# Altium schematic sheet Clocking.SchDoc: {Наименование}
size 420 x 297 mm; DocumentNumber: ПЛАС.ХХХХХХ.ХХХ ХХ; SheetNumber: 6; SheetTotal: 11; PageSetup: Record=PageOptions|CenterHorizontal=False|CenterVertical=False|PrintScale=0.95|XCorrection=0.00|YCorrection=0.00|PrintKind=1|BorderSize=5000000|LeftOffset=0|BottomOffset=0|Orientation=1|PaperLength=1000|PaperWidth=1000|Scale=100|PaperSource=15|PrintQuality=600|MediaType=1|DitherType=10|PaperKind=A4|PrintScaleMode=1; Rule: PcbType=ProtelPcb
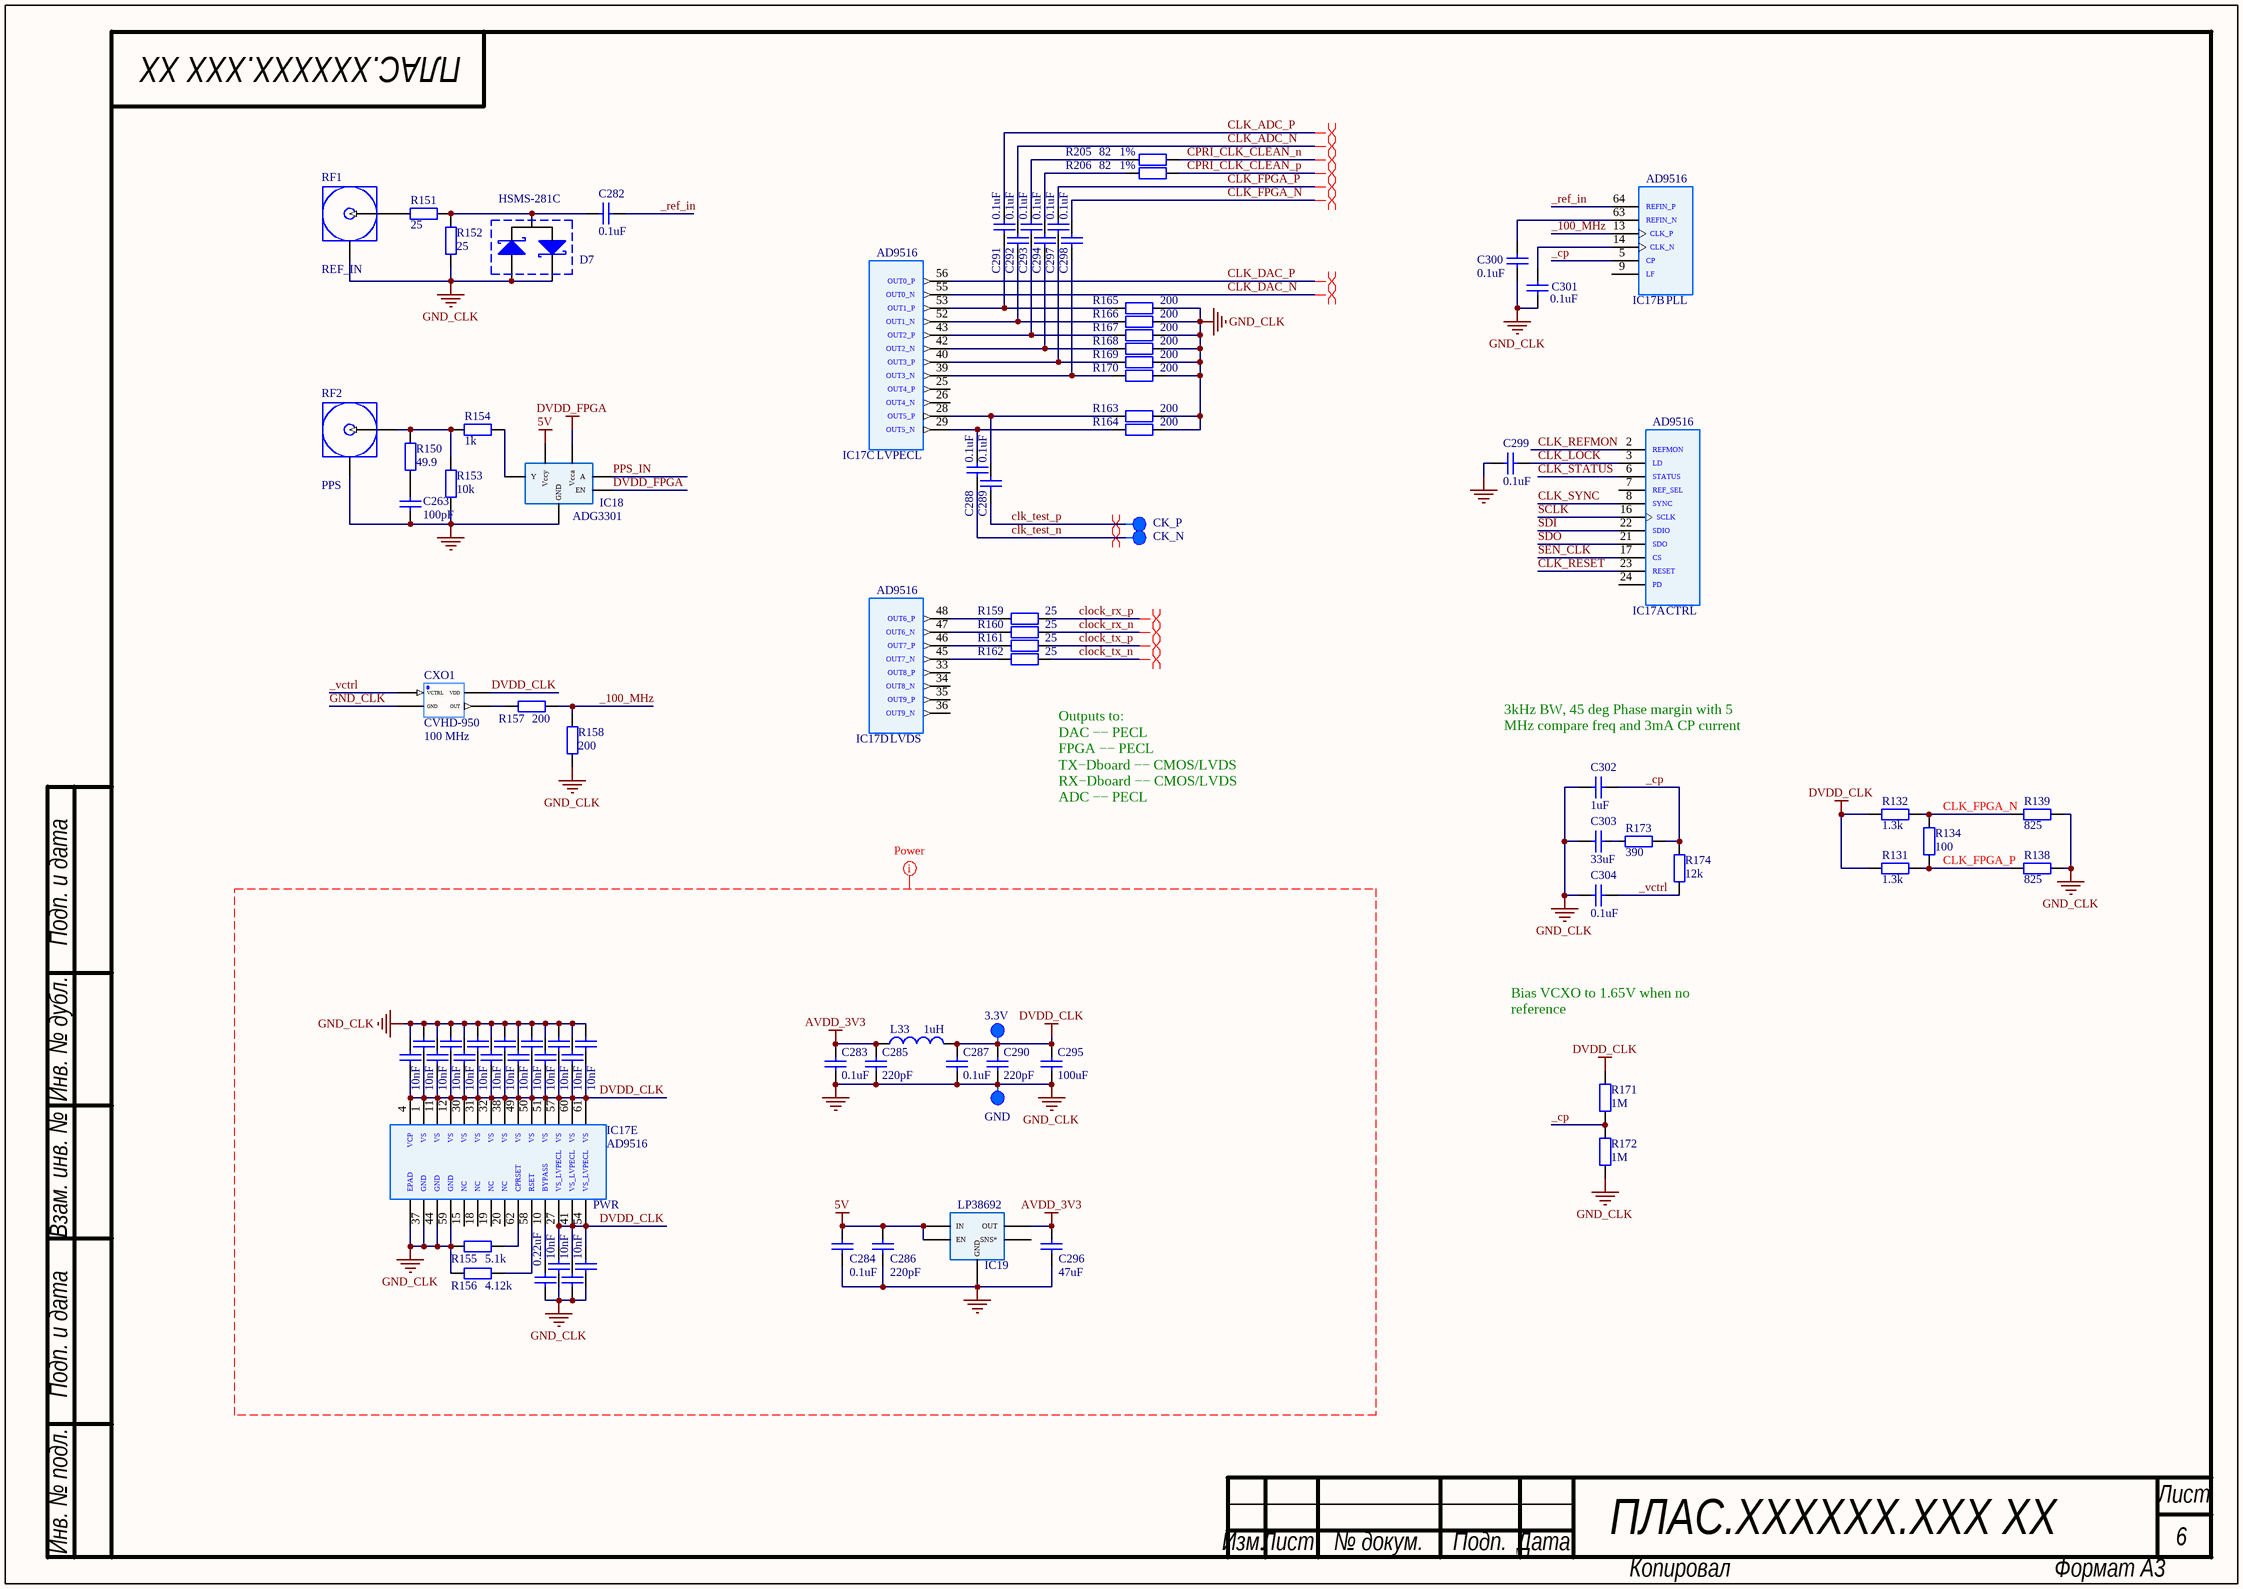
[diagram p0: Clocking.SchDoc]

## Parts
C263  value 100pF  [С0402]  (hidden comment: Cap)
C264  value 10nF  [С0402]  (hidden comment: Cap)
C265  value 10nF  [С0402]  (hidden comment: Cap)
C266  value 10nF  [С0402]  (hidden comment: Cap)
C267  value 10nF  [С0402]  (hidden comment: Cap)
C268  value 10nF  [С0402]  (hidden comment: Cap)
C269  value 10nF  [С0402]  (hidden comment: Cap)
C270  value 10nF  [С0402]  (hidden comment: Cap)
C271  value 10nF  [С0402]  (hidden comment: Cap)
C272  value 10nF  [С0402]  (hidden comment: Cap)
C273  value 10nF  [С0402]  (hidden comment: Cap)
C274  value 10nF  [С0402]  (hidden comment: Cap)
C275  value 0.22uF  [С0402]  (hidden comment: Cap)
C276  value 10nF  [С0402]  (hidden comment: Cap)
C277  value 10nF  [С0402]  (hidden comment: Cap)
C278  value 10nF  [С0402]  (hidden comment: Cap)
C279  value 10nF  [С0402]  (hidden comment: Cap)
C280  value 10nF  [С0402]  (hidden comment: Cap)
C281  value 10nF  [С0402]  (hidden comment: Cap)
C282  value 0.1uF  [С0402]  (hidden comment: Cap)
C283  value 0.1uF  [C0603]  (hidden comment: Cap)
C284  value 0.1uF  [C0603]  (hidden comment: Cap)
C285  value 220pF  [C0603]  (hidden comment: Cap)
C286  value 220pF  [C0603]  (hidden comment: Cap)
C287  value 0.1uF  [C0603]  (hidden comment: Cap)
C288  value 0.1uF  [С0402]  (hidden comment: Cap)
C289  value 0.1uF  [С0402]  (hidden comment: Cap)
C290  value 220pF  [C0603]  (hidden comment: Cap)
C291  value 0.1uF  [С0402]  (hidden comment: Cap)
C292  value 0.1uF  [С0402]  (hidden comment: Cap)
C293  value 0.1uF  [С0402]  (hidden comment: Cap)
C294  value 0.1uF  [С0402]  (hidden comment: Cap)
C295  value 100uF  [C1210]  (hidden comment: Cap)
C296  value 47uF  [C1210]  (hidden comment: Cap)
C297  value 0.1uF  [С0402]  (hidden comment: Cap)
C298  value 0.1uF  [С0402]  (hidden comment: Cap)
C299  value 0.1uF  [С0402]  (hidden comment: Cap)
C300  value 0.1uF  [С0402]  (hidden comment: Cap)
C301  value 0.1uF  [С0402]  (hidden comment: Cap)
C302  value 1uF  [C0603]  (hidden comment: Cap)
C303  value 33uF  [C1210]  (hidden comment: Cap)
C304  value 0.1uF  [C0603]  (hidden comment: Cap)
CP9  3.3V  [Control Point]
CP10  GND  [Control Point]
CP11  CK_P  [Control Point]
CP12  CK_N  [Control Point]
CXO1  CVHD-950  Frequency: 100 MHz  [CVHD-950]
D7  HSMS-281C  [SOT-323]
IC17  AD9516  [LFCSP-64]  (parts A,B,C,D,E of 5)
IC18  ADG3301  [SOT-23-6]
IC19  LP38692  [SOT-223-5]
L33  value 1uH  [L1210_Murata]  (hidden comment: Inductor_LF)
R131  value 1.3k  [R0402]  (hidden comment: Res)
R132  value 1.3k  [R0402]  (hidden comment: Res)
R134  value 100  [R0402]  (hidden comment: Res)
R138  value 825  [R0402]  (hidden comment: Res)
R139  value 825  [R0402]  (hidden comment: Res)
R150  value 49.9  [R0402]  (hidden comment: Res)
R151  value 25  [R0402]  (hidden comment: Res)
R152  value 25  [R0402]  (hidden comment: Res)
R153  value 10k  [R0402]  (hidden comment: Res)
R154  value 1k  [R0402]  (hidden comment: Res)
R155  value 5.1k  [R0402]  (hidden comment: Res)
R156  value 4.12k  [R0402]  (hidden comment: Res)
R157  value 200  [R0402]  (hidden comment: Res)
R158  value 200  [R0402]  (hidden comment: Res)
R159  value 25  [R0402]  (hidden comment: Res)
R160  value 25  [R0402]  (hidden comment: Res)
R161  value 25  [R0402]  (hidden comment: Res)
R162  value 25  [R0402]  (hidden comment: Res)
R163  value 200  [R0402]  (hidden comment: Res)
R164  value 200  [R0402]  (hidden comment: Res)
R165  value 200  [R0402]  (hidden comment: Res)
R166  value 200  [R0402]  (hidden comment: Res)
R167  value 200  [R0402]  (hidden comment: Res)
R168  value 200  [R0402]  (hidden comment: Res)
R169  value 200  [R0402]  (hidden comment: Res)
R170  value 200  [R0402]  (hidden comment: Res)
R171  value 1M  [R0402]  (hidden comment: Res)
R172  value 1M  [R0402]  (hidden comment: Res)
R173  value 390  [R0402]  (hidden comment: Res)
R174  value 12k  [R0402]  (hidden comment: Res)
R205  value 82  Tolerance: 1%  [R0402]  (hidden comment: Res)
R206  value 82  Tolerance: 1%  [R0402]  (hidden comment: Res)
RF1  REF_IN  [SMA Angle Female With Term]
RF2  PPS  [SMA Angle Female With Term]

## Nets
5V: C284.1 C286.1 IC18.6(Vccy) IC19.1(EN) IC19.4(IN)
AVDD_3V3: C283.1 C285.1 C296.1 IC19.3(OUT) L33.2
DVDD_CLK: C264.1 C265.2 C266.1 C267.2 C268.1 C269.2 C270.1 C271.2 C272.1 C273.2 C274.1 C276.2 C277.2 C278.1 C279.2 C280.2 C281.2 C287.1 C290.1 C295.2 CP9.1 CXO1.4(VDD) IC17.1(VS) IC17.4(VCP) IC17.11(VS) IC17.12(VS) IC17.27(VS_LVPECL) IC17.30(VS) IC17.31(VS) IC17.32(VS) IC17.38(VS) IC17.41(VS_LVPECL) IC17.49(VS) IC17.50(VS) IC17.51(VS) IC17.54(VS_LVPECL) IC17.57(VS) IC17.60(VS) IC17.61(VS) L33.1 R131.1 R132.1 R171.1
DVDD_FPGA: IC18.1(Vcca) IC18.4(EN)
GND_CLK: C263.1 C264.2 C265.1 C266.2 C267.1 C268.2 C269.1 C270.2 C271.1 C272.2 C273.1 C274.2 C275.1 C276.1 C277.1 C278.2 C279.1 C280.1 C281.1 C283.2 C284.2 C285.2 C286.2 C287.2 C290.2 C295.1 C296.2 C299.1 C300.2 C301.2 C302.1 C303.2 C304.1 CP10.1 CXO1.2(GND) D7.1(A) D7.2(K) IC17.0(EPAD) IC17.37(GND) IC17.44(GND) IC17.59(GND) IC18.3(GND) IC19.5(GND) R138.2 R139.1 R152.2 R153.1 R155.1 R156.1 R158.2 R163.1 R164.1 R165.1 R166.1 R167.1 R168.1 R169.1 R170.1 R172.2 RF1.0(GND) RF2.0(GND)  [also labelled GND]
_100_MHz: IC17.13(CLK_P) R157.1 R158.1
_cp: C302.2 IC17.5(CP) R171.2 R172.1 R173.1 R174.2
_ref_in: C282.1 IC17.64(REFIN_P)
_vctrl: C304.2 CXO1.1(VCTRL) R174.1
CLK_ADC_N: C292.1
CLK_ADC_P: C291.1
CLK_DAC_N: IC17.55(OUT0_N)
CLK_DAC_P: IC17.56(OUT0_P)
CLK_FPGA_N: C298.1 R132.2 R134.2 R139.2
CLK_FPGA_P: C297.1 R131.2 R134.1 R138.1
CLK_LOCK: C299.2 IC17.3(LD)
CLK_REFMON: IC17.2(REFMON)
CLK_RESET: IC17.23(RESET)
CLK_STATUS: IC17.6(STATUS)
CLK_SYNC: IC17.8(SYNC)
clk_test_n: C288.2 CP12.1
clk_test_p: C289.2 CP11.1
clock_rx_n: R160.1
clock_rx_p: R159.1
clock_tx_n: R162.1
clock_tx_p: R161.1
CPRI_CLK_CLEAN_n: R205.2
CPRI_CLK_CLEAN_p: R206.2
PPS_IN: IC18.2(A)
SCLK: IC17.16(SCLK)
SDI: IC17.22(SDIO)
SDO: IC17.21(SDO)
SEN_CLK: IC17.17(CS)
NetC263_2: C263.2 R150.1
NetC275_2: C275.2 IC17.10(BYPASS)
NetC282_2: C282.2 D7.3(K) R151.1 R152.1
NetC288_1: C288.1 IC17.29(OUT5_N) R164.2
NetC289_1: C289.1 IC17.28(OUT5_P) R163.2
NetC291_2: C291.2 IC17.53(OUT1_P) R165.2
NetC292_2: C292.2 IC17.52(OUT1_N) R166.2
NetC293_1: C293.1 R205.1
NetC293_2: C293.2 IC17.43(OUT2_P) R167.2
NetC294_1: C294.1 R206.1
NetC294_2: C294.2 IC17.42(OUT2_N) R168.2
NetC297_2: C297.2 IC17.40(OUT3_P) R169.2
NetC298_2: C298.2 IC17.39(OUT3_N) R170.2
NetC300_1: C300.1 IC17.63(REFIN_N)
NetC301_1: C301.1 IC17.14(CLK_N)
NetC303_1: C303.1 R173.2
NetCXO1_3: CXO1.3(OUT) R157.2
NetIC17_45: IC17.45(OUT7_N) R162.2
NetIC17_46: IC17.46(OUT7_P) R161.2
NetIC17_47: IC17.47(OUT6_N) R160.2
NetIC17_48: IC17.48(OUT6_P) R159.2
NetIC17_58: IC17.58(RSET) R156.2
NetIC17_62: IC17.62(CPRSET) R155.2
NetIC18_5: IC18.5(Y) R154.1
NetR150_2: R150.2 R153.2 R154.2 RF2.1(RF)
NetR151_2: R151.2 RF1.1(RF)

Not connected (* = marked no-connect by the designer): IC17 7(REF_SEL) 9(LF) 15(NC) 18(NC) 19(NC) 20(NC) 24(PD) 25(OUT4_P) 26(OUT4_N) 33(OUT8_P) 34(OUT8_N) 35(OUT9_P) 36(OUT9_N); IC19 6(SNS*)

## Layout directives
net class Power: 5V, AVDD_3V3, DVDD_CLK, GND, GND_CLK
differential pair: CLK_ADC_N, CLK_ADC_P, CLK_DAC_N, CLK_DAC_P, CLK_FPGA_N, CLK_FPGA_P, clk_test_n, clk_test_p, clock_rx_n, clock_rx_p, clock_tx_n, clock_tx_p, CPRI_CLK_CLEAN_n, CPRI_CLK_CLEAN_p

## Notes on the sheet
- (near C302) 3kHz BW, 45 deg Phase margin with 5 MHz compare freq and 3mA CP current
- Outputs to:
  DAC −− PECL
  FPGA −− PECL
  TX−Dboard −− CMOS/LVDS
  RX−Dboard −− CMOS/LVDS
  ADC −− PECL
- Bias VCXO to 1.65V when no reference
- Подп. и дата
- Инв. № дубл.
- Взам. инв. №
- Инв. № подл.
- Лист
- Изм.
- № докум.
- Подп.
- Дата
- Копировал
- Формат А3
- (in symbol AD9516, part A) CTRL
- (in symbol AD9516, part B) PLL
- (in symbol AD9516, part C) LVPECL
- (in symbol AD9516, part D) LVDS
- (in symbol AD9516, part E) PWR

## Library data of the parts
C263 C283-C287 C290 = Cer Cap: Cer Cap Small; Manufacturer: Murata; Material: x5r; Voltage: 16V; Tolerance: 10%; Type: Ceramic; PackageReference: SMD Chip Capacitor
  C263: Package: 0402
  C283-C287 C290: Package: 0603
C264-C274 C276-C281 = Cer Cap: Cer Cap Small; Manufacturer: Murata; Material: x7r; Voltage: 25V; Tolerance: 10%; Type: Ceramic; PackageReference: SMD Chip Capacitor; Package: 0402
C275 C282 C288 C289 C291-C294 C297-C301 C304 = Cer Cap: Cer Cap Small; Manufacturer: Murata; Material: x7r; Voltage: 16V; Tolerance: 10%; Type: Ceramic; PackageReference: SMD Chip Capacitor; Package: 0402
C295 C296 C303 = Cap uF: Cer Cap Large; Manufacturer: Murata; Material: x5r; Tolerance: 20%; Voltage: 6.3V; Type: Ceramic; Package: C1210; PackageDescription: SMD Chip Capacitor
C302 = Cer Cap: Cer Cap Small; Manufacturer: Murata; Material: x7r; Voltage: 10V; Tolerance: 10%; Type: Ceramic; PackageReference: SMD Chip Capacitor; Package: 0402
CP9-CP12 = Control Point: Name: Control Point
CXO1 = CVHD-950: Crystal Oscillator; Name: CVHD-950-100.000; Voltage: 3.3V ±0.3V; Output: Symmetry; Output Current: ±24mA Max; Input Current: 15mA Typical; Package: CVHD-950; Temperature Range: 0°C to +70°C
D7 = HSMS-281x: RF Schottky Barrier Diodes; Name: HSMS-281C; Package: SOT-323
IC17 = AD9516: 14-Output Clock Generator; Name: AD9516-4; Voltage: 2.5 V to 3.3 V; Input Frequency: 0 to 2.4 GHz; Output Frequency, Maximum: 2950 MHz; Input Sensitivity: 150 mV p-p; Type: 14-Output Clock Generator; Package: LFSCSP-64; Temperature Range: −40°C to +85°C
IC18 = ADG3301: Bidirectional Logic Level Translator; Voltage: 1.15 V to 5.5 V; Name: ADG3301; Package: SOT-23-6
IC19 = LP38692: Linear Regulator; Name: LP28692MP-3.3; Input Voltage: 2.7 V to 10 V; Output Accuracy: 2.5%; Dropout Voltage: 450 mV at 1 A; Package: SOT-223-5; Type: Linear Regulator; Temperature Range: –40°C to 125°C
L33 = Inductor_LF: Inductor_Power_Lines; Manufacturer: Murata; Name: LQM32PN1R0MG0; Tolerance: 5%; Current: 1800mA; Frequency: 40MHz; Package: 1210; PackageDescription: Chip Inductor; Temperature Range: -25…85; Series: LQM
R131 R132 R134 R138 R139 R150-R174 = Res: Resistor; Name: Chip SMD Resistor; Tolerance: 5%; Power: 0.062 Wt; Temperature Range: -55…155
  R131 R132 R134 R138 R139 R151 R152 R155-R174: Package: SMD
  R150 R153 R154: Package: 0402
R205 R206 = Res: Resistor; Name: Chip SMD Resistor; Power: 0.062 Wt; Package: SMD; Temperature Range: -55…155
RF1 RF2 = SMA Angle Female: SMA Male Right-Angle PCM Connector; Name: SMA Right Angle PCB Mount RF Connector; Type: SMA